# EAGLE schematic rs232module (EAGLE 6.5.0)
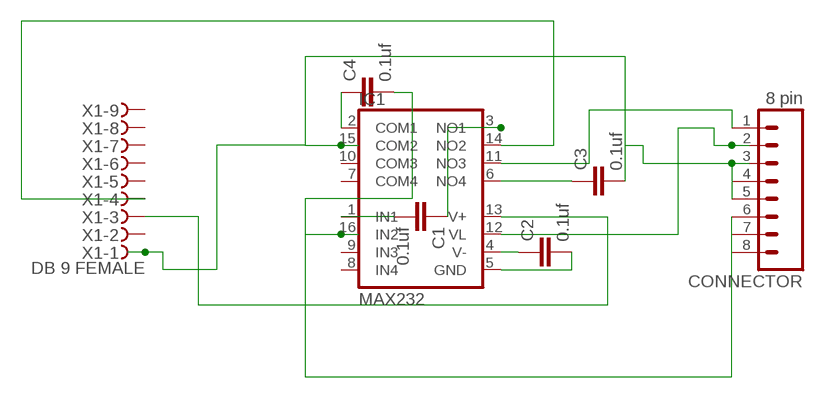
[diagram p0: schematic, sheet 1]

## Parts
C1  0.1uf  C2,5-3  [C2.5-3]
C2  0.1uf  C2,5-3  [C2.5-3]
C3  0.1uf  C2,5-3  [C2.5-3]
C4  0.1uf  C2,5-3  [C2.5-3]
CONNECTOR  8 pin  M08  [08P]
IC1  MAX232  MAX313EPE  [DIL16]
X1  DB 9 FEMALE  D-SUB9-H2M09ST  [H2M09ST]

## Nets
N$1: C1.2 IC1.1(IN1)
N$2: C1.1 IC1.3(NO1)
N$3: C2.1 IC1.4(V-)
N$4: C2.2 IC1.5(GND)
N$5: C3.1 IC1.6(NO4)
N$6: C3.2 CONNECTOR.3 CONNECTOR.4 CONNECTOR.5 IC1.15(COM2) X1.1
N$7: C4.1 IC1.2(COM1)
N$8: C4.2 CONNECTOR.6 CONNECTOR.7 CONNECTOR.8 IC1.16(IN2)
N$9: IC1.13(V+) X1.3
N$10: IC1.14(NO2) X1.4
N$11: CONNECTOR.1 IC1.11(NO3)
N$12: CONNECTOR.2 IC1.12(VL)
Unconnected: IC1.7(COM4) IC1.8(IN4) IC1.9(IN3) IC1.10(COM3) X1.2 X1.5 X1.6 X1.7 X1.8 X1.9

## Library data of the parts
C1-C4 = capacitor-wima:C: CAPACITOR naming: grid - package width
CONNECTOR = con-amp-quick:M08: AMP QUICK CONNECTOR; OC_FARNELL: unknown; OC_NEWARK: unknown
IC1 = maxim:MAX313: 10?, Quad, SPST, CMOS Analog Switches Source: http://datasheets.maxim-ic.com/en/ds/MAX312-MAX314.pdf; MPN: MAX313EPE+; OC_FARNELL: unknown; OC_NEWARK: 99K3220
X1 = con-thomas-betts:D-SUB9-: D-Subminiatur Connector Source: Electronioc Interconnects European Edition 1998; OC_FARNELL: unknown; OC_NEWARK: unknown